# EAGLE design 2D_Barcode_Scanner_Breakout (EAGLE 9.6.2)
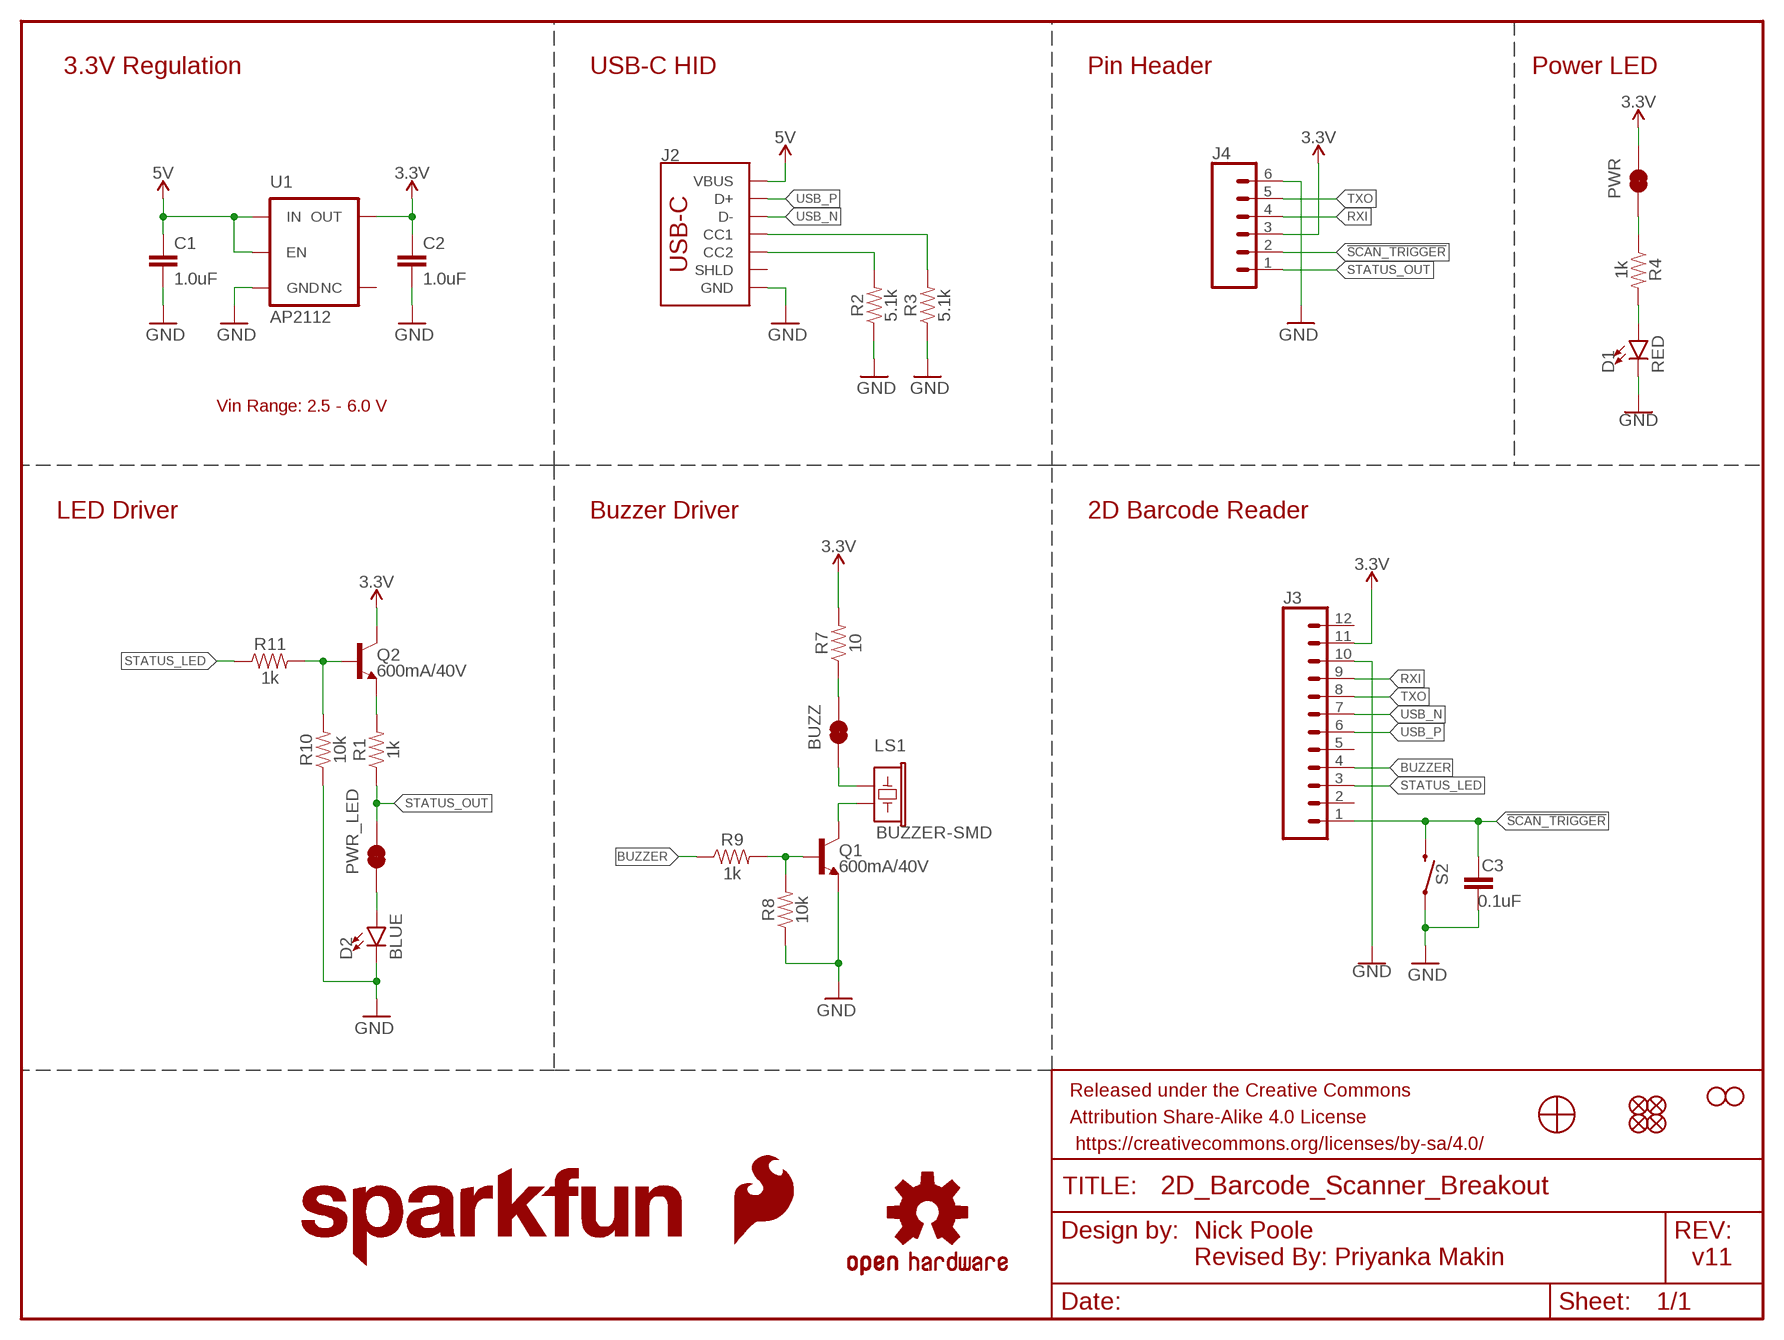
[diagram p0: schematic, sheet 1]

## Parts
BUZZ  JUMPER-SMT_2_NC_TRACE_SILK  [SMT-JUMPER_2_NC_TRACE_SILK]
C1  1.0uF  1.0UF-0603-16V-10%  [0603]
C2  1.0uF  1.0UF-0603-16V-10%  [0603]
C3  0.1uF  0.1UF-0603-25V-(+80/-20%)  [0603]
D1  RED  LED-RED0603  [LED-0603]
D2  BLUE  LED-BLUE0603  [LED-0603]
FD1  FIDUCIALUFIDUCIAL  [FIDUCIAL-MICRO]
FD2  FIDUCIALUFIDUCIAL  [FIDUCIAL-MICRO]
FD3  FIDUCIALUFIDUCIAL  [FIDUCIAL-MICRO]
FD4  FIDUCIALUFIDUCIAL  [FIDUCIAL-MICRO]
FRAME1  FRAME-LETTER  [CREATIVE_COMMONS]
H2  STAND-OFF  [STAND-OFF]
H3  STAND-OFF  [STAND-OFF]
J2  USB_C_2-LAYER_PADS  [USB-C-16P-2LAYER-PADS]
J3  CONN_12FPC_12_0.5MM  [FPC_12_0.5MM]
J4  CONN_06NO_SILK_FEMALE_PTH  [1X06_NO_SILK]
LOGO1  OSHW-LOGOS  [OSHW-LOGO-S]
LOGO2  SFE_LOGO_FLAME.1_INCH  [SFE_LOGO_FLAME_.1]
LOGO3  SFE_LOGO_NAME.1_INCH  [SFE_LOGO_NAME_.1]
LS1  BUZZER-SMD  [BUZZER-CCV]
PWR  JUMPER-SMT_2_NC_TRACE_SILK  [SMT-JUMPER_2_NC_TRACE_SILK]
PWR_LED  JUMPER-SMT_2_NC_TRACE_SILK  [SMT-JUMPER_2_NC_TRACE_SILK]
Q1  600mA/40V  TRANS_NPN-MMBT2222AL  [SOT23-3]
Q2  600mA/40V  TRANS_NPN-MMBT2222AL  [SOT23-3]
R1  1k  1KOHM-0603-1/10W-1%  [0603]
R2  5.1k  5.1KOHM5.1KOHM-0603-1/10W-1%  [0603]
R3  5.1k  5.1KOHM5.1KOHM-0603-1/10W-1%  [0603]
R4  1k  1KOHM-0603-1/10W-1%  [0603]
R7  10  10OHM-0603-1/10W-5%  [0603]
R8  10k  10KOHM-0603-1/10W-1%  [0603]
R9  1k  1KOHM-0603-1/10W-1%  [0603]
R10  10k  10KOHM-0603-1/10W-1%  [0603]
R11  1k  1KOHM-0603-1/10W-1%  [0603]
S2  MOMENTARY-SWITCH-SPST-SMD-5.2MM-TALL  [TACTILE_SWITCH_SMD_5.2MM]
U1  3.3V  V_REG_AP2112K-3.3V  [SOT23-5]
U2  BARCODE_SCANNER_MOUNT  [BARCODE_SCANNER_MOUNT]

## Nets
3.3V [power]: C2.1 J3.11 J4.3 PWR.2 Q2.3(C) R7.2 U1.5(OUT)
5V: C1.1 J2.VBUS1(VBUS) J2.VBUS2(VBUS) U1.1(IN) U1.3(EN)
!SCAN_TRIGGER!: C3.1 J3.1 J4.2 S2.3
BUZZER: J3.4 R9.1
CC3: J2.A5(CC1) R3.2
CC4: J2.B5(CC2) R2.2
GND [power]: C1.2 C2.2 C3.2 D1.C D2.C J2.GND J2.GND2(GND) J3.10 J4.6 Q1.2(E) R2.1 R3.1 R8.1 R10.1 S2.1 U1.2(GND)
N$1: BUZZ.2 R7.1
N$2: LS1.- Q1.3(C)
N$3: BUZZ.1 LS1.+
N$4: Q2.2(E) R1.2
N$5: Q1.1(B) R8.2 R9.2
N$6: PWR.1 R4.1
N$7: Q2.1(B) R10.2 R11.2
N$8: D2.A PWR_LED.1
N$9: D1.A R4.2
RXI: J3.9 J4.4
STATUS_LED: J3.3 R11.1
STATUS_OUT: J4.1 PWR_LED.2 R1.1
TXO: J3.8 J4.5
USB_N: J2.A7(D-) J2.B7(D-) J3.7
USB_P: J2.A6(D+) J2.B6(D+) J3.6
Unconnected: J2.SHLD1(SHLD) J2.SHLD2(SHLD) J2.SHLD3(SHLD) J2.SHLD4(SHLD) J3.2 J3.5 J3.12 U1.4(NC)

## Notes on the sheet
- 3.3V Regulation | USB-C HID | Pin Header | Power LED
- AP2112
- Vin Range: 2.5 - 6.0 V
- LED Driver | Buzzer Driver | 2D Barcode Reader
- Nick Poole
  Revised By: Priyanka Makin
- v11

## Library data of the parts
BUZZ PWR PWR_LED = SparkFun-Jumpers:JUMPER-SMT_2_NC_TRACE: Normally closed trace jumper This jumper has a trace between two pads so it's normally closed (NC). Use a razor knife to open the connection. For best results follow the IPC guidelines for cutting traces: Cutout at least 0.063 mm (0.005 in). Remove all loose material to clean up the cut area. Seal the cut with an approved epoxy. Reapply solder to reclose the connection.
C1 C2 = SparkFun-Capacitors:1.0UF: 1µF ceramic capacitors A capacitor is a passive two-terminal electrical component used to store electrical energy temporarily in an electric field.; PROD_ID: CAP-00868
C3 = SparkFun-Capacitors:0.1UF: 0.1µF ceramic capacitors A capacitor is a passive two-terminal electrical component used to store electrical energy temporarily in an electric field.; PROD_ID: CAP-00810
D1 = SparkFun-LED:LED-RED: Red SMD LED Used in manufacturing of most products at SparkFun Packages: 0603 - SMD 0603 package [Product Link] <http://docs.avagotech.com/docs/AV02-0551EN> 0603 SMART - SMD 0603 SMART package ( more efficient and expensive)[Product Link] <http://www.osram-os.com/Graphics/XPic2/00077099_0.pdf> 1206 - SMD1206 package [Product Link] <https://www.sparkfun.com/datasheets/DevTools/LilyPad/Q150OVS4.pdff> SparkFun Products: Pro Mini 328 -5V <https://www.sparkfun.com/products/821> RedBoard <https://www.sparkfun.com/products/12757> IOIO-OTG <https://www.sparkfun.com/products/13613>; PROD_ID: DIO-00819
D2 = SparkFun-LED:LED-BLUE: Blue SMD LED Used in manufacturing of various products at SparkFun Packages: 0603 - SMD 0603 package [Product Link] <http://www.digikey.com/product-detail/en/SMLE12BC7TT86/511-1589-2-ND/1641808> 1206 - SMD1206 package [Product Link] <http://www.digikey.com/product-detail/en/lite-on-inc/LTST-C150TBKT/160-1643-1-ND/573584> SparkFun Products: ESP8266 Thing-Dev Board <https://www.sparkfun.com/products/13711> RedBoard <https://www.sparkfun.com/products/12757>; PROD_ID: DIO-08575
FD1-FD4 = SparkFun-Aesthetics:FIDUCIAL: Fiducial Alignment Points Point-of-reference for pick-and-place machines and other optical instruments.
FRAME1 = SparkFun-Aesthetics:FRAME-LETTER: Schematic Frame - Letter Standard 8.5x11 US Letter frame
H2 H3 = SparkFun-Hardware:STAND-OFF: Stand Off Drill holes for mechanically mounting via screws, standoffs, etc. Note: Use the keepout ring to avoid running the screw head into surrounding components. Variant Overviews STAND-OFF - Mechanical footprint for a #4 phillips button head screw. STAND-OFF-TIGHT - Mechanical footprint for a #4 phillips button head screw, Example SparkFun Products Screw - Phillips Head (1/4", 4-40, 10 pack) <https://www.sparkfun.com/products/10453> (PRT-10453) Screw - Phillips Head (1/2", 4-40, 10 pack) <https://www.sparkfun.com/products/10452> (PRT-10452) Screw - Phillips Head (3/4", 4-40, 10 pack) <https://www.sparkfun.com/products/10451> (PRT-10451) Screw - Phillips Head (1", 4-40, 10 pack) <https://www.sparkfun.com/products/10450> (PRT-10450)
J2 = SparkFun-Connectors:USB_C: USB Type C 16Pin Connector Super Speed pins not available on the 16-pin purely SMD connector so this part is best for USB 2.0 implementations. D1 and D2 are tied together enabling D+/- no matter which way the cable is plugged into the connector. The two channel configuration pins (CC1/2) are exposed. These are normally connected to ground via 5.1k resistors but can be reconfigured for high current/high power applications. **4-LAYER BOARD WARNING!!** If designing 4-layer board, make sure to select the variant _4-LAYER-ISOLATED. The linked footprint (USB-C-16-4LAYER-ISOLATED) includes some very necessary cutout polygons in the inner layers (2 and 15). This prevents the PTH mounting shield legs on the USB connector from electrically connecting any other polygons on the inner layers (usually VCC and GND).; PROD_ID: CONN-14122
J3 = SparkFun-Connectors:CONN_12: Multi connection point. Often used as Generic Header-pin footprint for 0.1 inch spaced/style header connections On any of the 0.1 inch spaced packages, you can populate with these: Break Away Headers - Straight <https://www.sparkfun.com/products/116> (PRT-00116) Break Away Male Headers - Right Angle <https://www.sparkfun.com/products/553> (PRT-00553) Female Headers <https://www.sparkfun.com/products/115> (PRT-00115) Break Away Headers - Machine Pin <https://www.sparkfun.com/products/117> (PRT-00117) Break Away Female Headers - Swiss Machine Pin <https://www.sparkfun.com/products/743> (PRT-00743) For SCREWTERMINALS and SPRING TERMINALS visit here: Screw Terimnals on SparkFun.com <https://www.sparkfun.com/search/results?term=Screw+Terminals> (5mm/3.5mm/2.54mm spacing) This device is also useful as a general connection point to wire up your design to another part of your project. Our various solder wires solder well into these plated through hole pads. Hook-Up Wire - Assortment (Stranded, 22 AWG) <https://www.sparkfun.com/products/11375> (PRT-11375) Hook-Up Wire - Assortment (Solid Core, 22 AWG) <https://www.sparkfun.com/products/11367> (PRT-11367) View the entire wire category on our website here <https://www.sparkfun.com/categories/141> Special notes: Molex polarized connector foot print use with SKU : PRT-08231 with associated crimp pins and housings. 1MM SMD Version SKU: PRT-10208 NOTES ON THE VARIANTS LOCK and LOCK_LONGPADS... This footprint was designed to help hold the alignment of a through-hole component (i.e. 6-pin header) while soldering it into place. You may notice that each hole has been shifted either up or down by 0.005 of an inch from it's more standard position (which is a perfectly straight line). This slight alteration caused the pins (the squares in the middle) to touch the edges of the holes. Because they are alternating, it causes a "brace" to hold the component in place. 0.005 has proven to be the perfect amount of "off-center" position when using our standard breakaway headers. Although looks a little odd when you look at the bare footprint, once you have a header in there, the alteration is very hard to notice. Also,if you push a header all the way into place, it is covered up entirely on the bottom side.; PROD_ID: CONN-15766
J4 = SparkFun-Connectors:CONN_06: Multi connection point. Often used as Generic Header-pin footprint for 0.1 inch spaced/style header connections On any of the 0.1 inch spaced packages, you can populate with these: Break Away Headers - Straight <https://www.sparkfun.com/products/116> (PRT-00116) Break Away Male Headers - Right Angle <https://www.sparkfun.com/products/553> (PRT-00553) Female Headers <https://www.sparkfun.com/products/115> (PRT-00115) Break Away Headers - Machine Pin <https://www.sparkfun.com/products/117> (PRT-00117) Break Away Female Headers - Swiss Machine Pin <https://www.sparkfun.com/products/743> (PRT-00743) Arduino Stackable Header - 6 Pin <https://www.sparkfun.com/products/9280> (PRT-09280) For SCREWTERMINALS and SPRING TERMINALS visit here: Screw Terimnals on SparkFun.com <https://www.sparkfun.com/search/results?term=Screw+Terminals> (5mm/3.5mm/2.54mm spacing) This device is also useful as a general connection point to wire up your design to another part of your project. Our various solder wires solder well into these plated through hole pads. Hook-Up Wire - Assortment (Stranded, 22 AWG) <https://www.sparkfun.com/products/11375> (PRT-11375) Hook-Up Wire - Assortment (Solid Core, 22 AWG) <https://www.sparkfun.com/products/11367> (PRT-11367) View the entire wire category on our website here <https://www.sparkfun.com/categories/141>; PROD_ID: CONN-08437
LOGO1 = SparkFun-Aesthetics:OSHW-LOGO: Open-Source Hardware (OSHW) Logo This logo indicates the piece of hardware it is found on incorporates a OSHW license and/or adheres to the definition of open source hardware found here: http://freedomdefined.org/OSHW
LOGO2 = SparkFun-Aesthetics:SFE_LOGO_FLAME: SparkFun Flame Logo This is the SparkFun flame logo. The logo on the schematic will always be the same size; the package variant is the height of the flame. Default layer for the logo on the board is tSilk.
LOGO3 = SparkFun-Aesthetics:SFE_LOGO_NAME: SparkFun Font Logo This is the SparkFun name logo. The logo on the schematic will always be the same size; the package variant is the height of the flame part of the logo (or the height the flame would be, if it were drawn). Default layer for the logo on the board is tSilk.
LS1 = SparkFun-Electromechanical:BUZZER: Buzzer Small round buzzers that operate around the audible 2kHz range. You can use these as speakers to create simple music or user interfaces. Variant Overview: PTH - Mini Speaker - PC Mount 12mm 2.048kHz <https://www.sparkfun.com/products/7950> PTH_KIT - Mini Speaker - PC Mount 12mm 2.048kHz <https://www.sparkfun.com/products/7950> KIT simplifies soldering by adding stop mask to one side of the pads. PTH_NO_SILK - Mini Speaker - PC Mount 12mm 2.048kHz <https://www.sparkfun.com/products/7950> No silkscreen indicator of buzzer outline. PTH_KIT_NO_SILK - Mini Speaker - PC Mount 12mm 2.048kHz <https://www.sparkfun.com/products/7950> KIT package w/o silkscreen SMD - Buzzer Audio Magnetic (CCV-084B16) SMD buzzer used on, e.g. the LilyPad Buzzer <https://www.sparkfun.com/products/8463> and RFID USB Reader <https://www.sparkfun.com/products/9963>. SMD_KIT - Buzzer Audio Magnetic (CCV-084B16) SMD Buzzer with elongated pins to make soldering easier. Used on the SparkFun Simon Says - Surface Mount Soldering Kit <https://www.sparkfun.com/products/10935>.; PROD_ID: COMP-08568
Q1 Q2 = SparkFun-DiscreteSemi:TRANS_NPN: NPN transistor Current controlled devices typically used to amplify current or used as a switch. BC547 - COM-08928 <http://www.sparkfun.com/products/8928> (TO-92 45V 100mA) (1.Collector 2.Base 3.Emitter) 2N3904 - COM-00521 <http://www.sparkfun.com/products/521> (TO-92 40V 200mA) (1.Emitter 2.Base 3.Collector) P2N2222A - COM-12852 <http://www.sparkfun.com/products/12852> (TO-92 40V 600mA) (1.Collector 2.Base 3.Emitter); PROD_ID: TRANS-08049
R1 R4 R9 R11 = SparkFun-Resistors:1KOHM: 1kΩ resistor A resistor is a passive two-terminal electrical component that implements electrical resistance as a circuit element. Resistors act to reduce current flow, and, at the same time, act to lower voltage levels within circuits. - Wikipedia; PROD_ID: RES-07856
R2 R3 = SparkFun-Resistors:5.1KOHM; PROD_ID: RES-12083
R7 = SparkFun-Resistors:10OHM: 10Ω resistor A resistor is a passive two-terminal electrical component that implements electrical resistance as a circuit element. Resistors act to reduce current flow, and, at the same time, act to lower voltage levels within circuits. - Wikipedia; PROD_ID: RES-09834
R8 R10 = SparkFun-Resistors:10KOHM: 10kΩ resistor A resistor is a passive two-terminal electrical component that implements electrical resistance as a circuit element. Resistors act to reduce current flow, and, at the same time, act to lower voltage levels within circuits. - Wikipedia; PROD_ID: RES-00824
S2 = SparkFun-Switches:MOMENTARY-SWITCH-SPST: Momentary Switch (Pushbutton) - SPST Normally-open (NO) SPST momentary switches (buttons, pushbuttons). Variants PTH-12MM - 12mm square, through-hole Momentary Pushbutton Switch - 12mm Square <https://www.sparkfun.com/products/9190> (COM-09190) PTH-6.0MM, PTH-6.0MM-KIT - 6.0mm square, through-hole Mini Pushbutton Switch <https://www.sparkfun.com/products/97> (COM-00097) KIT package intended for soldering kit's - only one side of pads' copper is exposed. PTH-RIGHT-ANGLE-KIT - Right-angle, through-hole Right Angle Tactile Button <https://www.sparkfun.com/products/10791> - Used on SparkFun BigTime Watch Kit <https://www.sparkfun.com/products/11734> SMD-12MM - 12mm square, surface-mount Tactile Button - SMD (12mm) <https://www.sparkfun.com/products/12993> (COM-12993) Used on SparkFun PicoBoard <https://www.sparkfun.com/products/11888> SMD-4.5MM - 4.5mm Square Trackball Switch Used on SparkFun Blackberry Trackballer Breakout <https://www.sparkfun.com/products/13169> SMD-4.6MMX2.8MM - 4.60mm x 2.80mm, surface mount Used on SparkFun Pro Micro - RP2040 <https://www.sparkfun.com/products/17717> SMD-5.2MM, SMD-5.2-REDUNDANT - 5.2mm square, surface-mount Mini Pushbutton Switch - SMD <https://www.sparkfun.com/products/8720> (COM-08720) Used on Arduino Pro Mini <https://www.sparkfun.com/products/11114> REDUNDANT package connects both switch circuits together SMD-6.0X3.5MM - 6.0 x 3.5mm, surface mount Momentary Reset Switch SMD <https://www.sparkfun.com/products/8229> (COM-08229) SMD-6.2MM-TALL - 6.2mm square, surface mount Tactile Button - SMD (6mm) <https://www.sparkfun.com/products/12992> Used on SparkFun Digital Sandbox <https://www.sparkfun.com/products/12651> SMD-RIGHT-ANGLE - Right-angle, surface mount Used on SparkFun Block for Intel® Edison - Arduino <https://www.sparkfun.com/products/13036>; PROD_ID: SWCH-14139
U1 = SparkFun-IC-Power:V_REG_AP2112: AP2112 - 600mA CMOS LDO Regulator w/ Enable The AP2112 is CMOS process low dropout linear regulator with enable function, the regulator delivers a guaranteed 600mA (min.) continuous load current. Features Output Voltage Accuracy: ±1.5% Output Current: 600mA (Min.) Foldback Short Current Protection: 50mA Enable Function to Turn ON/OFF VOUT Low Dropout Voltage (3.3V): 250mV (Typ.) @IOUT=600mA Excellent Load Regulation: 0.2%/A (Typ.) Excellent Line Regulation: 0.02%/V (Typ.) Low Quiescent Current: 55μA (Typ.) Low Standby Current: 0.01μA (Typ.) Low Output Noise: 50μVRMS PSRR: 100Hz -65dB, 1kHz -65dB OTSD Protection Stable with 1.0μF Flexible Cap: Ceramic, Tantalum and Aluminum Electrolytic Operation Temperature Range: -40°C to 85°C ESD: MM 400V, HBM 4000V; PROD_ID: VREG-12457
U2 = SparkFun-Hardware:BARCODE_SCANNER_MOUNT; PROD_ID: LPA-14926

## Net classes
1 power: width 0.178 mm

## Board
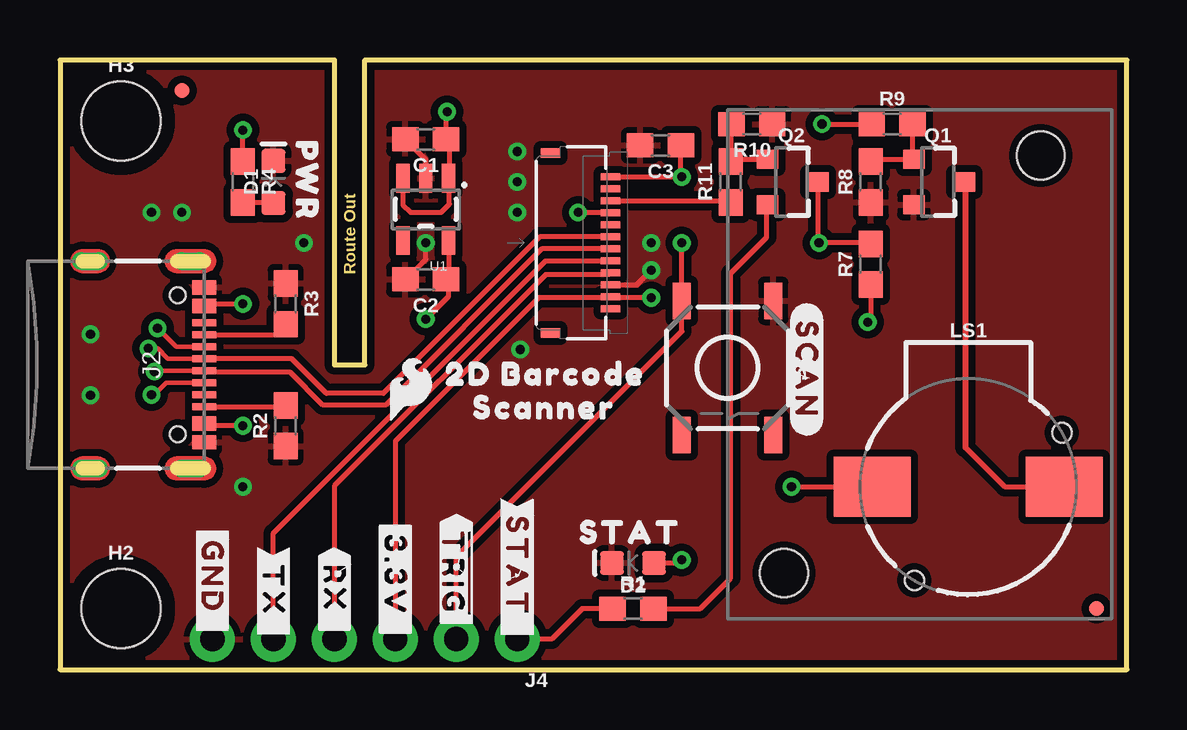
[diagram p1: board, top side]
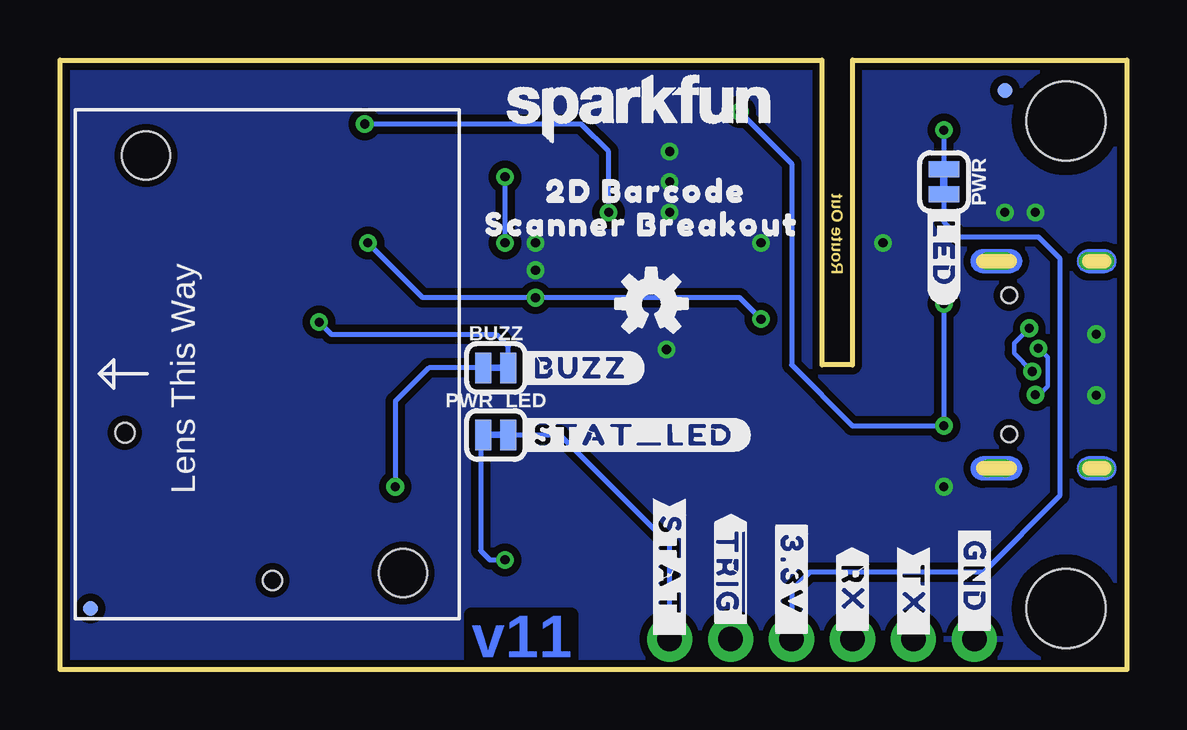
[diagram p2: board, bottom side, seen from below]

Size 44.45 x 25.4 mm. Coordinates in mm from the lower left corner, seen from the top.
Outline: 11.43,25.4 11.43,12.7 12.7,12.7 12.7,25.4 44.45,25.4 44.45,0 0,0 0,25.4 11.43,25.4
Copper layers (1*16): Top 0.035mm / dielectric 1.5mm / Bottom 0.035mm
Design rules "SparkFun-2-Layer-General-JLCPCB": minimum track width 7mil, minimum drill 0.3mm, track to track 7mil, track to pad 7mil, pad to pad 7mil, via to via 7mil, smd to smd 7mil, copper to edge 7mil, drill to drill 7mil, minimum pad ring 7mil, minimum via ring 7mil, stop-mask expansion 3mil, vias tented up to drill 25mil, thermal gap 10mil

### Footprints (pad centres in the part's own frame; a part is rotated, then mirrored left to right if it is on the bottom)
SMT-JUMPER_2_NC_TRACE_SILK = smd 0.66 x 1.27: 1 -0.521,0; 2 0.521,0
0603 = smd 1.1 x 1: 1 -0.85,0; 2 0.85,0
LED-0603 = smd 1 x 1: A -0.877,0; C 0.877,0
FIDUCIAL-MICRO = smd 0.635 x 0.635: 1 0,0
STAND-OFF = hole 3.302: 0,0
USB-C-16P-2LAYER-PADS = smd 0.3 x 1: A5 -1.25,-0.34; A6 -0.25,-0.34; A7 0.25,-0.34; A8 1.25,-0.34; B5 1.75,-0.34; B6 0.75,-0.34; B7 -0.75,-0.34; B8 -1.75,-0.34 | smd 0.6 x 1: GND -3.225,-0.34; GND2 3.225,-0.34; VBUS1 -2.45,-0.34; VBUS2 2.45,-0.34 | drill 0.4 pad 0.6 long: SHLD1 -4.318,-0.915; SHLD2 4.318,-0.915; SHLD3 -4.318,-5.095; SHLD4 4.318,-5.095 | hole 0.65: -2.89,-1.445; 2.89,-1.445
FPC_12_0.5MM = smd 0.3 x 0.8: 1 -2.75,1.35; 2 -2.25,1.35; 3 -1.75,1.35; 4 -1.25,1.35; 5 -0.75,1.35; 6 -0.25,1.35; 7 0.25,1.35; 8 0.75,1.35; 9 1.25,1.35; 10 1.75,1.35; 11 2.25,1.35; 12 2.75,1.35 | smd 0.4 x 0.8: MP1 -3.75,-1.15; MP2 3.75,-1.15
1X06_NO_SILK = drill 1.016 pad 1.88: 1 0,0; 2 2.54,0; 3 5.08,0; 4 7.62,0; 5 10.16,0; 6 12.7,0
BUZZER-CCV = smd 3.2 x 2.5: + 4,0; - -4,0 | hole 0.8: -3.9,-2.25; 2.25,3.9
SOT23-3 = smd 0.8 x 0.9: 1 -0.95,-1; 2 0.95,-1; 3 0,1.1
TACTILE_SWITCH_SMD_5.2MM = smd 1.524 x 0.762: 1 -2.794,1.905; 2 2.794,1.905; 3 -2.794,-1.905; 4 2.794,-1.905
SOT23-5 = smd 0.55 x 1.2: 1 -0.95,-1.3; 2 0,-1.3; 3 0.95,-1.3; 4 0.95,1.3; 5 -0.95,1.3
BARCODE_SCANNER_MOUNT = hole 2: -5.65,8.3; 5.05,-9.1

### Placement (x,y rotation side)
BUZZ  26.29,12.57 0 bottom
C1  15.24,22.1 180 top
C2  15.24,16.26 180 top
C3  25.02,21.84 180 top
D1  8.89,20.32 90 top
D2  23.88,4.45 180 top
FD1  5.08,24.13 0 top
FD2  43.18,2.54 0 top
FD3  43.18,2.54 0 bottom
FD4  5.08,24.13 0 bottom
FRAME1  1.27,-10.16 0 top  (outside the outline)
H2  2.54,2.54 0 top
H3  2.54,22.86 0 top
J2  6.35,12.7 270 top
J3  21.59,17.78 270 top
J4  19.05,1.27 180 top
LOGO1  19.81,15.24 0 bottom
LOGO2  14.61,11.68 0 top
LOGO3  20.32,23.37 0 bottom
LS1  37.85,7.62 180 top
PWR  7.62,20.32 270 bottom
PWR_LED  26.29,9.78 0 bottom
Q1  36.58,20.32 270 top
Q2  30.48,20.32 270 top
R1  23.88,2.54 0 top
R2  9.4,10.16 90 top
R3  9.4,15.24 270 top
R4  7.62,20.32 270 top
R7  33.78,16.89 90 top
R8  33.78,20.32 90 top
R9  34.67,22.73 0 top
R10  28.83,22.73 180 top
R11  27.94,20.32 90 top
S2  27.81,12.57 270 top
U1  15.24,19.18 180 top
U2  35.81,12.32 180 bottom
U$1  [##TRIG##0]  16.51,6.48 270 top
U$2  [#STAT_#0]  19.05,7.11 270 top
U$3  [STAT0]  20.95,5.71 0 top
U$4  [#SCAN#0]  31.11,15.24 270 top
U$5  [#BUZZ#0]  25.4,12.57 0 bottom
U$6  [#STAT_LED#0]  25.4,9.78 0 bottom
U$7  [##TRIG##0]  16.51,6.48 270 bottom
U$8  [PWR0]  10.29,22.73 270 top
U$9  [#LED#0]  7.62,19.43 270 bottom
U$17  [2D_BARCODE0]  15.37,12.32 0 top
U$18  [2D_BARCODE0]  24.89,19.94 0 bottom
U$19  [SCANNER0]  16.51,10.92 0 top
U$20  [SCANNER_BREAKOUT0]  27.43,18.54 0 bottom
U$21  [#STAT_#0]  19.05,7.11 270 bottom
U$26  [#TX_#0]  8.89,5.08 270 top
U$27  [#TX_#0]  8.89,5.08 270 bottom
U$28  [#3#3V_#0]  13.97,6.35 270 top
U$29  [#3#3V_#0]  13.97,6.35 270 bottom
U$30  [#RX_#0]  11.43,5.08 270 top
U$31  [#RX_#0]  11.43,5.08 270 bottom
U$32  [#GND_#0]  6.35,6.1 270 top
U$33  [#GND_#0]  6.35,6.1 270 bottom

### Tracks (layer width: path | path; a pad name or v marks a point on that pad's centre or on a via)
3.3V  (via drill 0.38)
  Top 0.203: J4.3 13.97,9.53 19.94,15.49 22.9,15.49 J3.11 22.98,15.49 v24.64,15.49 | R7.2 33.74,17.78 v31.62,17.78 31.58,17.82 Q2.3 | 16.19,16.36 C2.1 | U1.5 16.19,16.36 | 16.19,16.36 16.19,15.55 v15.24,14.61
  Bottom 0.203: v15.24,14.61 16.13,15.49 v24.64,15.49 29.34,15.49 v31.62,17.78 | PWR.2 7.62,18.67 6.99,18.03 3.68,18.03 2.79,17.14 2.79,7.24 5.97,4.06 13.21,4.06 13.97,3.3 J4.3
5V  (via drill 0.38)
  Top 0.178: 16.22,20.45 U1.1
  Top 0.203: J2.VBUS1 6.1,15.24 v7.62,15.24 | v7.62,10.16 6.1,10.16 J2.VBUS2 | v16.13,23.24 16.09,23.2 C1.1 16.22,21.97 16.22,20.45 16.22,19.39 15.88,19.05 14.61,19.05 14.29,19.36 U1.3
  Bottom 0.203: v7.62,15.24 v7.62,10.16 11.43,10.16 13.97,12.7 13.97,21.08 v16.13,23.24
!SCAN_TRIGGER!  (via drill 0.38)
  Top 0.203: v25.91,17.78 S2.3 25.91,14.1 16.51,4.7 J4.2 | C3.1 25.87,20.57 v25.91,20.53 J3.1
  Bottom 0.203: v25.91,17.78 v25.91,20.53
BUZZER  (via drill 0.38)
  Top 0.203: v31.75,22.73 R9.1 | J3.4 21.61,19.03 v21.59,19.05
  Bottom 0.203: v21.59,19.05 21.59,21.59 22.73,22.73 v31.75,22.73
CC3
  Top 0.178: J2.A5 6.29,13.95
  Top 0.203: 6.29,13.95 8.96,13.95 R3.2
CC4
  Top 0.203: J2.B5 9.34,10.95 R2.2
GND  (via drill 0.38)
  Top 0.203: C1.2 15.24,21.25 U1.2 | C2.2 15.24,17.11 v15.24,17.78 | J3.10 24.03,16.03 v24.64,16.64
  other vias: 5.08,19.05 3.81,19.05 10.16,17.78 1.27,13.97 1.27,11.43 19.18,13.34 24.64,17.78 19.05,21.59 19.05,20.32 19.05,19.05 7.62,7.62
  pour Top (isolate 0.305): 0,0 44.45,0 44.45,25.4 0,25.4
  pour Bottom (isolate 0.305): 0,25.4 0,0 44.45,0 44.45,25.4
N$1  (via drill 0.38)
  Top 0.203: R7.1 33.78,14.61 v33.66,14.48
  Bottom 0.203: v33.66,14.48 33.15,13.97 26.28,13.97 25.77,13.46 BUZZ.2
N$2
  Top 0.178: Q1.3 37.73,20.27
  Top 0.203: 37.73,9.26 39.37,7.62 LS1.-
  Top 0.254: 37.73,20.27 37.73,9.26
N$3  (via drill 0.38)
  Top 0.203: v30.48,7.62 LS1.+
  Bottom 0.203: BUZZ.1 29.08,12.57 30.48,11.18 v30.48,7.62
N$4
  Top 0.203: Q2.2 29.44,19.33 29.44,18.01 27.94,16.51 27.94,3.81 26.67,2.54 R1.2
N$5
  Top 0.203: R8.2 33.88,21.27 Q1.1 35.52,21.32 R9.2
N$6  (via drill 0.38)
  Top 0.203: R4.1 v7.62,22.48
  Bottom 0.203: v7.62,22.48 PWR.1
N$7
  Top 0.203: R10.2 27.98,21.21 R11.2 28.04,21.27 Q2.1
N$8  (via drill 0.38)
  Top 0.203: v25.91,4.57 25.78,4.45 D2.A
  Bottom 0.203: PWR_LED.1 26.92,9.66 26.92,4.95 26.54,4.57 v25.91,4.57
N$9
  Top 0.203: D1.A 7.65,19.44 R4.2
RXI
  Top 0.203: J3.9 22.87,16.46 20.24,16.46 11.43,7.65 J4.4
STATUS_LED
  Top 0.203: R11.1 27.88,19.53 J3.3
STATUS_OUT
  Top 0.203: R1.1 21.76,2.54 20.49,1.27 J4.1
  Bottom 0.203: PWR_LED.2 23.62,9.78 19.05,5.21 J4.1
TXO
  Top 0.203: J4.5 8.89,5.68 20.24,17.03 J3.8
USB_N  (via drill 0.38)
  Top 0.178: J2.B7 4.84,13.45 v4.06,14.22 | J2.A7 3.97,12.45 v3.94,12.42
  Top 0.203: J2.A7 6.07,12.39 9.59,12.39 10.96,11.02 13.56,11.02 20.07,17.53 J3.7
  Bottom 0.178: v4.06,14.22 4.7,13.59 4.7,13.18 v3.94,12.42
USB_P  (via drill 0.38)
  Top 0.178: J2.A6 4.5,12.95 4.06,13.39 v3.68,13.39 | J2.B6 4.43,11.95 3.94,11.46 v3.81,11.46
  Top 0.203: J2.A6 9.66,12.95 11.1,11.51 13.48,11.51 20,18.03 J3.6
  Bottom 0.178: v3.68,13.39 3.3,13.01 3.3,11.81 3.66,11.46 v3.81,11.46

### Text on the board
Bottom: v11
Dimension: Route Out
tDocu: Nick Poole / Revised by: Priyanka Makin